# Altium schematic sheet VoltageMeasurement.SchDoc
size A4; SheetNumber: 1; SheetTotal: 3; Schematic: Voltage Measurement
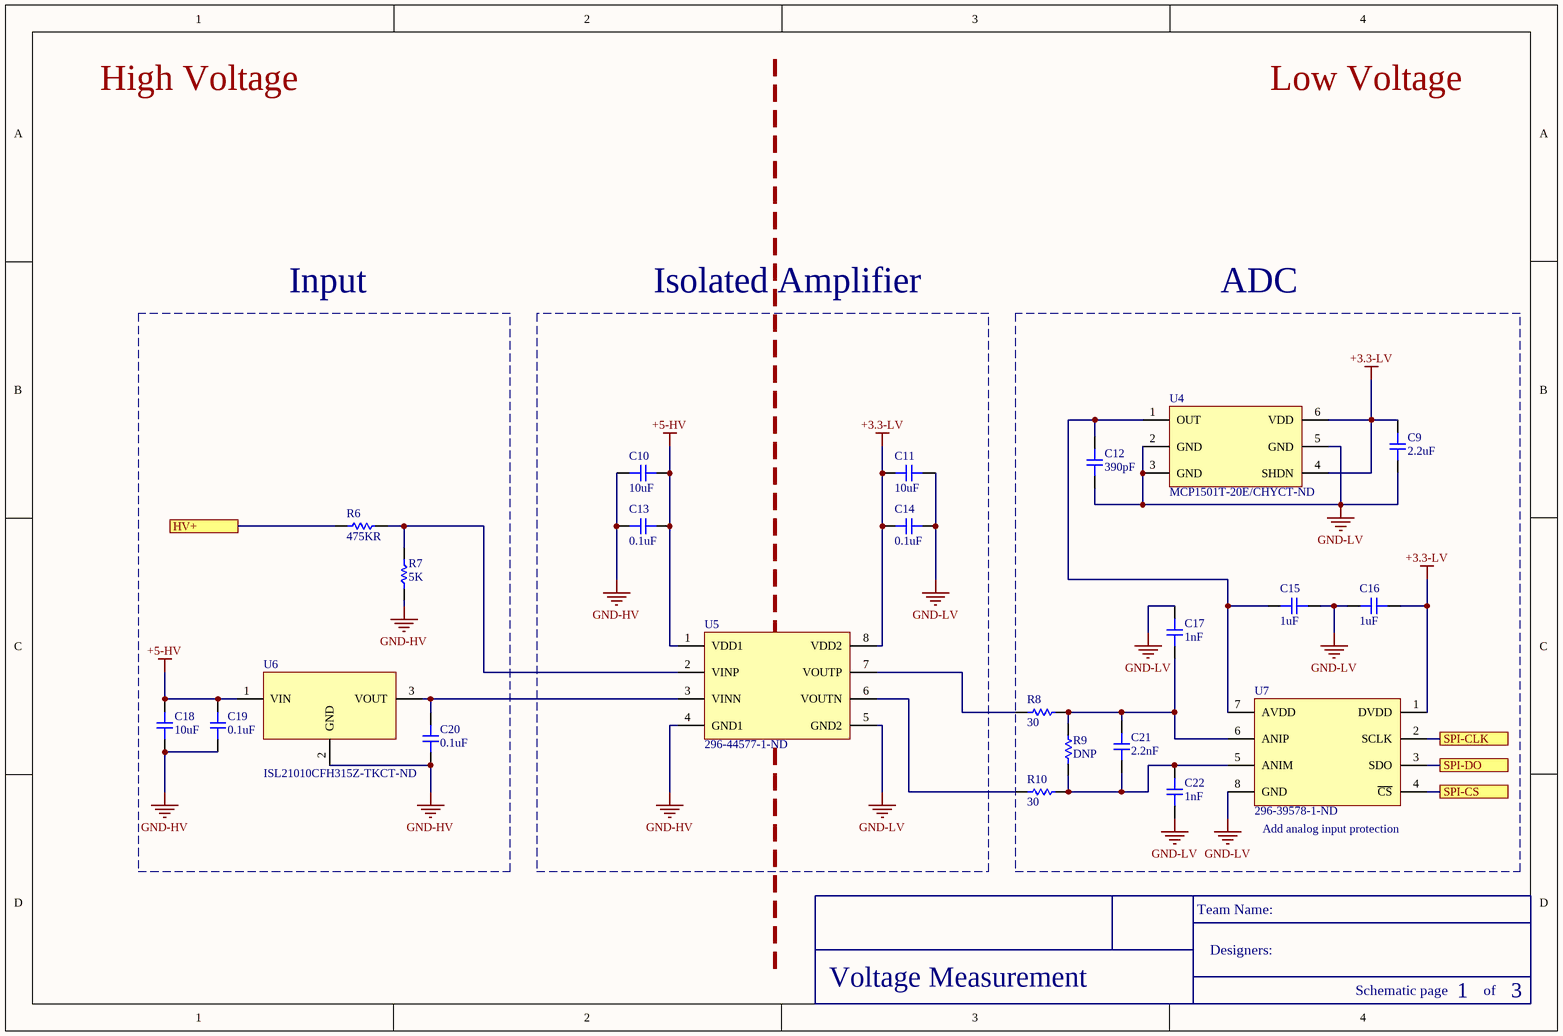
[diagram p0: VoltageMeasurement.SchDoc]

## Parts
C9  2.2uF  [CAP-0603]
C10  10uF  [CAP-1206]
C11  10uF  [CAP-1206]
C12  390pF  [CAP-0805]
C13  0.1uF  [CAP-0805]
C14  0.1uF  [CAP-0805]
C15  1uF  [CAP-0805]
C16  1uF  [CAP-0805]
C17  1nF  [CAP-0603]
C18  10uF  [CAP-1206]
C19  0.1uF  [CAP-0805]
C20  0.1uF  [CAP-0805]
C21  2.2nF  [CAP-0603]
C22  1nF  [CAP-0603]
R6  475KR  [RES-0805]
R7  5K  [RES-0603]
R8  30  [RES-0805]
R9  DNP  [RES-0805]
R10  30  [RES-0805]
U4  MCP1501T-20E/CHYCT-ND  [SOT-23-6]
U5  296-44577-1-ND  [8-SOICW]
U6  ISL21010CFH315Z-TKCT-ND  [SOT-23-3]
U7  296-39578-1-ND  [8VSSOP]

## Blocks framed on the sheet
Input: C18-C20 R6 R7 U6
Isolated Amplifier: C10 C11 C13 C14 U5
ADC: C9 C12 C15-C17 C21 C22 R8-R10 U4 U7

## Ports
HV+, SPI-CLK, SPI-CS, SPI-DO

## Nets
+3.3-LV: C9.2 C11.1 C14.1 C16.2 U4.4(SHDN) U4.6(VDD) U5.8(VDD2) U7.1(DVDD)
+5-HV: C10.2 C13.2 C18.2 C19.2 U5.1(VDD1) U6.1(VIN)
GND-HV: C10.1 C13.1 C18.1 C19.1 C20.1 R7.1 U5.4(GND1) U6.2(GND)
GND-LV: C9.1 C11.2 C12.1 C14.2 C15.2 C16.1 C17.2 C22.1 U4.2(GND) U4.3(GND) U4.5(GND) U5.5(GND2) U7.8(GND)
HV+: R6.1 ; port HV+
SPI-CLK: U7.2(SCLK) ; port SPI-CLK
SPI-CS: U7.4(~{CS}) ; port SPI-CS
SPI-DO: U7.3(SDO) ; port SPI-DO
NetC12_2: C12.2 C15.1 U4.1(OUT) U7.7(AVDD)
NetC17_1: C17.1 C21.2 R8.2 R9.2 U7.6(ANIP)
NetC20_2: C20.2 U5.3(VINN) U6.3(VOUT)
NetC21_1: C21.1 C22.2 R9.1 R10.2 U7.5(ANIM)
NetR6_2: R6.2 R7.2 U5.2(VINP)
NetR8_1: R8.1 U5.7(VOUTP)
NetR10_1: R10.1 U5.6(VOUTN)

## Notes on the sheet
- (near U7) Add analog input protection
- High Voltage
- Low Voltage
- Team Name:
- Designers:
- Schematic page
- of

## Library data of the parts
C9 = 0603-2.2uF-25V: CAP CER 2.2UF 25V X5R 0603; Manufacturer: Murata; Manufacturer Part Number: GRM188R61E225MA12D; Tolerance: 20%; Supplier 1: Digi-Key; Stock 1: 132633; Pricing 1: 1=0.16, 10=0.115, 100=0.0539, 500=0.03782, 1000=0.0313 (USD); Mount: Surface Mount; Case/Package: 0603; Weight: 0.000222oz; Case Code (Metric): 1608; Case Code (Imperial): 0603; Min Operating Temperature: -55°C; Max Operating Temperature: 85°C; Capacitance: 2.2uF; Packaging: Tape and Reel; Voltage Rating: 25V; Dielectric: X5R; Termination: SMD/SMT; Composition: Ceramic; Voltage Rating (DC): 25V; Package Quantity: 4000; Length: 0.063inch; Height: 0.8mm; Width: 0.031inch; Thickness: 0.035inch; ComponentLink1URL: http://search.murata.co.jp/Ceramy/image/img/A01X/G101/ENG/GRM188R61E225MA12-01.pdf?src-supplier=Digi-Key; ComponentLink1Description: http://search.murata.co.jp/Ceramy/image/img/A01X/G101/ENG/GRM188R61E225MA12-01.pdf?src-supplier=Digi-Key; ComponentLink2URL: http://www.mouser.com/ds/2/281/c02e-2905.pdf?src-supplier=Mouser; ComponentLink2Description: http://www.mouser.com/ds/2/281/c02e-2905.pdf?src-supplier=Mouser; Supplier Part Number 1: 490-12738-6-ND
C10 C11 C18 = 1206-10uF-50V: CAP CER 10UF 50V X5R 1206; Manufacturer: Murata; Manufacturer Part Number: GRT31CR61H106ME01L; Tolerance: 20%; Supplier 1: Digi-Key; Stock 1: 247205; Pricing 1: 1=0.5, 10=0.349, 100=0.2092, 500=0.1569, 1000=0.13249 (USD); Mount: Surface Mount; Case/Package: 1206; Case Code (Metric): 3216; Case Code (Imperial): 1206; Min Operating Temperature: -55°C; Max Operating Temperature: 85°C; Packaging: Tape and Reel; Capacitance: 10uF; Voltage Rating: 50V; Length: 0.126inch; Width: 0.063inch; Thickness: 0.071inch; Ratings: AEC-Q200; ComponentLink1URL: http://search.murata.co.jp/Ceramy/image/img/A01X/G101/ENG/GRT31CR61H106ME01-01.pdf?src-supplier=Digi-Key; ComponentLink1Description: http://search.murata.co.jp/Ceramy/image/img/A01X/G101/ENG/GRT31CR61H106ME01-01.pdf?src-supplier=Digi-Key; Supplier Part Number 1: 490-12457-1-ND
C12 = 0805-390pF-50V: CAP CER 390PF 50V C0G/NP0 0805; Manufacturer: KEMET; Manufacturer Part Number: C0805C391J5GACTU; Dielectric Material: Ceramic; Tolerance: 5%; Dissipation Factor: 0.1%; Dielectric: C0G; Supplier 1: Digi-Key; Stock 1: 12778; Pricing 1: 1=0.15, 10=0.105, 100=0.0495, 500=0.03472, 1000=0.02875 (USD); Mount: Surface Mount,PCB; Case/Package: 0805; Case Code (Metric): 2012; Case Code (Imperial): 0805; Contact Material: Tin; Contact Plating: Tin,Matte; Min Operating Temperature: -55°C; Max Operating Temperature: 125°C; Package Quantity: 1; Capacitance: 390pF; Voltage Rating: 50V; Packaging: Tape and Reel; Termination: SMD/SMT; Voltage Rating (DC): 50V; Voltage: 50V; Length: 2mm; Height: 0.78mm; Width: 0.049inch; Lead Pitch: 0.75mm; Depth: 1.25mm; Thickness: 0.035inch; Radiation Hardening: No; REACH SVHC: No SVHC; Lead Free: Lead Free; ComponentLink1URL: https://search.kemet.com/component-edge/download/datasheet/C0805C391J5GACTU.pdf?src-supplier=Digi-Key; ComponentLink1Description: https://search.kemet.com/component-edge/download/datasheet/C0805C391J5GACTU.pdf?src-supplier=Digi-Key; ComponentLink2URL: https://www.verical.com/server-webapp/html/getDatasheet?partID=35246&src-supplier=Verical; ComponentLink2Description: https://www.verical.com/server-webapp/html/getDatasheet?partID=35246&src-supplier=Verical; ComponentLink3URL: https://www.alliedelec.com/m/d/9bfe7773041ffe9d406e68bc7b377fdd.pdf?src-supplier=Allied+Electronics; ComponentLink3Description: https://www.alliedelec.com/m/d/9bfe7773041ffe9d406e68bc7b377fdd.pdf?src-supplier=Allied+Electronics; ComponentLink4URL: http://www.farnell.com/datasheets/1372242.pdf?src-supplier=Element14; ComponentLink4Description: http://www.farnell.com/datasheets/1372242.pdf?src-supplier=Element14; ComponentLink5URL: http://www.jameco.com/Jameco/Products/ProdDS/1567367.pdf?src-supplier=Jameco; ComponentLink5Description: http://www.jameco.com/Jameco/Products/ProdDS/1567367.pdf?src-supplier=Jameco; Supplier Part Number 1: 399-1132-6-ND
C13 C14 C19 C20 = 0805-0.1uF-16V: CAP CER 0.1UF 16V Y5V 0805; Manufacturer: KEMET; Manufacturer Part Number: C0805C104Z4VACTU; Dielectric Material: Ceramic; Capacitance: 100nF; Tolerance: 80%; Supplier 1: Digi-Key; Stock 1: 18565; Pricing 1: 1=0.11, 10=0.081, 100=0.038, 500=0.02664, 1000=0.02205 (USD); Mount: Surface Mount; Case/Package: 0805; Case Code (Metric): 2012; Case Code (Imperial): 0805; Min Operating Temperature: -30°C; Max Operating Temperature: 85°C; Package Quantity: 1; Voltage Rating: 16V; Packaging: Tape and Reel; Voltage Rating (DC): 16V; Dielectric: Y5V; Termination: SMD/SMT; Length: 2mm; Height: 0.78mm; Width: 0.049inch; Thickness: 0.035inch; Lead Pitch: 0.75mm; Depth: 1.25mm; Lead Free: Lead Free; ComponentLink1URL: https://search.kemet.com/component-edge/download/datasheet/C0805C104Z4VACTU.pdf?src-supplier=Digi-Key; ComponentLink1Description: https://search.kemet.com/component-edge/download/datasheet/C0805C104Z4VACTU.pdf?src-supplier=Digi-Key; ComponentLink2URL: https://api.kemet.com/component-edge/download/datasheet/C0805C104Z4VACTU.pdf?src-supplier=Digi-Key; ComponentLink2Description: https://api.kemet.com/component-edge/download/datasheet/C0805C104Z4VACTU.pdf?src-supplier=Digi-Key; ComponentLink3URL: http://www.mouser.com/ds/2/212/KEM_C1005_Y5V_SMD-1101305.pdf?src-supplier=Mouser; ComponentLink3Description: http://www.mouser.com/ds/2/212/KEM_C1005_Y5V_SMD-1101305.pdf?src-supplier=Mouser; ComponentLink4URL: http://components.arrow.com/part/dataview/2091119S8993596N7429?src-supplier=Arrow; ComponentLink4Description: http://components.arrow.com/part/dataview/2091119S8993596N7429?src-supplier=Arrow; Supplier Part Number 1: 399-9159-6-ND
C15 C16 = 0805-1uF-16V: CAP CER 1UF 16V Y5V 0805; Manufacturer: KEMET; Manufacturer Part Number: C0805C105Z4VACTU; Dielectric Material: Ceramic; Tolerance: 80%; Dissipation Factor: 7%; Supplier 1: Digi-Key; Stock 1: 54729; Pricing 1: 1=0.12, 10=0.085, 100=0.0378, 500=0.02702, 1000=0.02124 (USD); Mount: Surface Mount,PCB; Case/Package: 0805; Number of Pins: 2; Case Code (Metric): 2012; Case Code (Imperial): 0805; Contact Material: Tin; Min Operating Temperature: -30°C; Max Operating Temperature: 85°C; Package Quantity: 1; Capacitance: 1uF; Voltage Rating: 16V; Packaging: Tape and Reel; Voltage Rating (DC): 16V; Dielectric: Y5V; Termination: SMD/SMT; Voltage: 16V; Length: 2mm; Height: 1.25mm; Width: 0.049inch; Thickness: 0.055inch; Lead Pitch: 0.75mm; Depth: 1.25mm; Radiation Hardening: No; REACH SVHC: No SVHC; Lead Free: Lead Free; ComponentLink1URL: http://www.farnell.com/datasheets/2739656.pdf?src-supplier=Farnell; ComponentLink1Description: http://www.farnell.com/datasheets/2739656.pdf?src-supplier=Farnell; ComponentLink2URL: http://capacitoredge.kemet.com/capedge2/DataSheet?pn=C0805C105Z4VAC7800&src-supplier=Avnet+Europe; ComponentLink2Description: http://capacitoredge.kemet.com/capedge2/DataSheet?pn=C0805C105Z4VAC7800&src-supplier=Avnet+Europe; ComponentLink3URL: https://www.alliedelec.com/m/d/9bfe7773041ffe9d406e68bc7b377fdd.pdf?src-supplier=Allied+Electronics; ComponentLink3Description: https://www.alliedelec.com/m/d/9bfe7773041ffe9d406e68bc7b377fdd.pdf?src-supplier=Allied+Electronics; ComponentLink4URL: http://www.farnell.com/datasheets/2739656.pdf?src-supplier=Newark; ComponentLink4Description: http://www.farnell.com/datasheets/2739656.pdf?src-supplier=Newark; Supplier Part Number 1: 399-8011-6-ND
C17 C22 = 0603-1nF-50V: CAP CER 1000PF 50V X7R 0603; Manufacturer: KEMET; Manufacturer Part Number: C0603C102J5RACTU; Dielectric Material: Ceramic; Tolerance: 5%; Dissipation Factor: 2.5%; Supplier 1: Digi-Key; Stock 1: 378254; Pricing 1: 1=0.1, 10=0.056, 100=0.0248, 500=0.01772, 1000=0.01392 (USD); Mount: Surface Mount; Case/Package: 0603; Number of Pins: 2; Case Code (Imperial): 0603; Case Code (Metric): 1608; Min Operating Temperature: -55°C; Max Operating Temperature: 125°C; Packaging: Tape and Reel; Capacitance: 1nF; Dielectric: X7R; Voltage Rating (DC): 50V; Package Quantity: 1; Voltage Rating: 50V; Termination: SMD/SMT; Length: 1.6mm; Height: 0.8mm; Width: 0.031inch; Depth: 0.8mm; Thickness: 0.034inch; Lead Pitch: 0.7mm; Radiation Hardening: No; REACH SVHC: No SVHC; ComponentLink1URL: http://www.onlinecomponents.com/productFiles/mf-KEM/docfinderpartnumberc0402c102k5ractu.pdf?src-supplier=Onlinecomponents.com; ComponentLink1Description: http://www.onlinecomponents.com/productFiles/mf-KEM/docfinderpartnumberc0402c102k5ractu.pdf?src-supplier=Onlinecomponents.com; Supplier Part Number 1: 399-1083-6-ND
C21 = 0603-2.2nF-50V: CAP CER SMD 0603 2200PF 10% X7R; Manufacturer: KEMET; Manufacturer Part Number: C0603C222K5RAC7411; Dielectric Material: Ceramic; Voltage Rating: 50V; Dissipation Factor: 2.5%; Supplier 1: Digi-Key; Stock 1: 56383; Pricing 1: 1=0.1, 10=0.042, 100=0.0186, 500=0.01328, 1000=0.01044, 2500=0.00949, 5000=0.00873 (USD); Mount: Surface Mount; Case/Package: 0603; Case Code (Imperial): 0603; Case Code (Metric): 1608; Min Operating Temperature: -55°C; Max Operating Temperature: 125°C; Capacitance: 2.2nF; Tolerance: 10%; Package Quantity: 10000; Packaging: Tape and Reel; Voltage Rating (DC): 50V; Dielectric: X7R; Termination: SMD/SMT; Length: 1.6mm; Height: 0.8mm; Width: 0.8mm; Lead Pitch: 0.7mm; Depth: 0.8mm; Radiation Hardening: No; ComponentLink1URL: http://www.mouser.com/ds/2/212/KEM_C1002_X7R_SMD-1102033.pdf?src-supplier=Mouser; ComponentLink1Description: http://www.mouser.com/ds/2/212/KEM_C1002_X7R_SMD-1102033.pdf?src-supplier=Mouser; Supplier Part Number 1: 399-17586-6-ND
R6 = 0805-475KR: RES 475K OHM 0.1% 1/8W 0805; Supplier 1: Digi-Key; Supplier Part Number 1: P475KDACT-ND
R7 = 0603-5KR: RES SMD 4.99K OHM 1% 1/10W 0603; Manufacturer: Bourns; Manufacturer Part Number: CR0603-FX-4991ELF; Resistance: 4.99kR; Power Rating: 100mW; Voltage Rating: 50V; Temperature Coefficient: 100ppm/°C; Supplier 1: Digi-Key; Stock 1: 70557; Pricing 1: 1=0.1, 10=0.02, 25=0.0144, 50=0.011, 100=0.0082, 250=0.00624, 500=0.00498, 1000=0.00367 (USD); Mount: Surface Mount; Case/Package: 0603; Case Code (Imperial): 0603; Case Code (Metric): 1608; Contact Plating: Tin; Min Operating Temperature: -55°C; Max Operating Temperature: 155°C; Tolerance: 1%; Packaging: Tape and Reel; Package Quantity: 1; Composition: Thick Film; Termination: SMD/SMT; Number of Terminations: 2; Max Power Dissipation: 100mW; Features: Moisture Resistant; Length: 0.063inch; Height: 0.022inch; Width: 0.8mm; Thickness: 457um; Radiation Hardening: No; ComponentLink1URL: https://www.bourns.com/docs/Product-Datasheets/CHPREZTR.pdf?src-supplier=Digi-Key; ComponentLink1Description: https://www.bourns.com/docs/Product-Datasheets/CHPREZTR.pdf?src-supplier=Digi-Key; ComponentLink2URL: http://www.bourns.com/pdfs/chpreztr.pdf?src-supplier=Avnet; ComponentLink2Description: http://www.bourns.com/pdfs/chpreztr.pdf?src-supplier=Avnet; Supplier Part Number 1: CR0603-FX-4991ELFDKR-ND
R8 R10 = 0805-30R: RES SMD 30 OHM 1% 1/8W 0805; Supplier 1: Digi-Key; Supplier Part Number 1: P30.0CCT-ND
U4 = VREF 2.048V 0.1%: IC VREF SERIES 0.1% SOT23-6; Supplier 1: Digi-Key; Supplier Part Number 1: MCP1501T-20E/CHYCT-ND
U5 = OPAMP-ISO-AMC1301DWVR: IC OPAMP ISOLATION 1 CIRC 8SOIC; Manufacturer: Texas Instruments; Number of Circuits: 1; Gain Bandwidth Product: 1MHz; Input Bias Current: 60uA; Input Offset Voltage (Vos): 50uV; Operating Supply Current: 5.9mA; Output Current per Channel: 13mA; Isolation Voltage: 1kV; Bandwidth: 210kHz; Supplier 1: Digi-Key; Manufacturer Part Number: AMC1301DWVR; Stock 1: 2458; Pricing 1: 1=6.07, 10=5.487, 25=5.2316, 100=4.3384, 250=3.9556, 500=3.7004 (USD); Mount: Surface Mount; Case/Package: SOIC; Number of Pins: 8; Min Operating Temperature: -40°C; Max Operating Temperature: 125°C; Packaging: Cut Tape; Number of Amplifiers: 1; REACH SVHC: No SVHC; Lead Free: Lead Free; ComponentLink1URL: http://www.ti.com/lit/wp/sszy024/sszy024.pdf?src-supplier=Digi-Key; ComponentLink1Description: http://www.ti.com/lit/wp/sszy024/sszy024.pdf?src-supplier=Digi-Key; ComponentLink2URL: http://www.ti.com/lit/ds/symlink/amc1301.pdf?src-supplier=Farnell; ComponentLink2Description: http://www.ti.com/lit/ds/symlink/amc1301.pdf?src-supplier=Farnell; ComponentLink3URL: http://www.farnell.com/datasheets/2113482.pdf?src-supplier=Element14; ComponentLink3Description: http://www.farnell.com/datasheets/2113482.pdf?src-supplier=Element14; Supplier Part Number 1: 296-44577-6-ND
U6 = VREF 1.5V 0.2%: IC VREF SERIES 0.2% SOT23-3; Supplier 1: Digi-Key; Supplier Part Number 1: ISL21010CFH315Z-TKCT-ND
U7 = ADC-ADS7044IDCUR: IC ADC 12BIT SAR 8VSSOP; Manufacturer: Texas Instruments; Manufacturer Part Number: ADS7044IDCUT; Number of Bits: 12; Sampling Rate: 1MS/s; Number of Inputs: 1; Interface: SPI; Resolution: 12b; Polarity: Unipolar; Signal to Noise Ratio (SNR): 71dB; Supply Type: Analog,Digital; Max Power Dissipation: 900uW; Min Dual Supply Voltage: 1.8V; Max Supply Voltage: 3.6V; Integral Nonlinearity (INL): 2LSB; Supplier 1: Digi-Key; Stock 1: 68; Pricing 1: 1=2.66, 10=2.385, 25=2.2544, 100=1.8537 (USD); Mount: Surface Mount; Case/Package: SOP; Number of Pins: 8; Weight: 0.030018oz; Contact Plating: Gold; Min Operating Temperature: -40°C; Max Operating Temperature: 125°C; Packaging: Tape and Reel; Number of A/D Converters: 1; Number of Analog Inputs: 1; Number of Channels: 1; Package Quantity: 250; Max Dual Supply Voltage: 3.6V; Lead Free: Lead Free; ComponentLink1URL: http://www.ti.com/general/docs/lit/getliterature.tsp?genericPartNumber=ADS7044&&fileType=pdf&src-supplier=Avnet; ComponentLink1Description: http://www.ti.com/general/docs/lit/getliterature.tsp?genericPartNumber=ADS7044&&fileType=pdf&src-supplier=Avnet; ComponentLink2URL: http://www.ti.com/lit/ds/symlink/ads7044.pdf?src-supplier=Digi-Key; ComponentLink2Description: http://www.ti.com/lit/ds/symlink/ads7044.pdf?src-supplier=Digi-Key; ComponentLink3URL: http://www.ti.com/lit/gpn/ads7044?src-supplier=Mouser; ComponentLink3Description: http://www.ti.com/lit/gpn/ads7044?src-supplier=Mouser; Supplier Part Number 1: 296-39578-6-ND